# Altium schematic sheet BackPage.SchDoc: Back Page
size Letter; Engineer: Nathan Petersen; DocumentNumber: 26; SheetNumber: 26; SheetTotal: 26
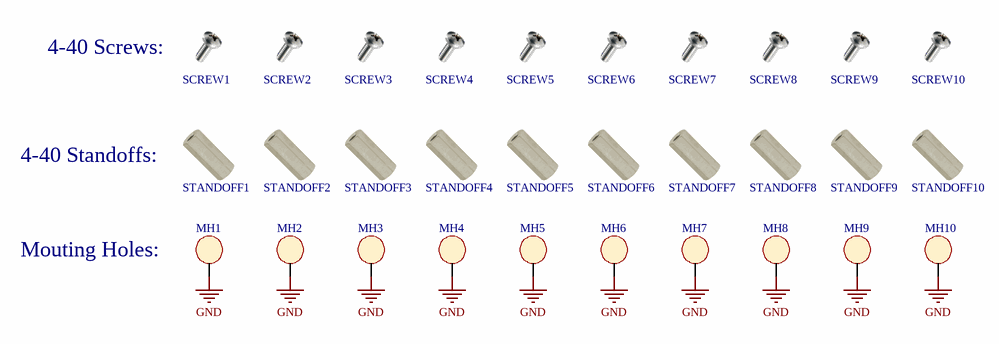
[diagram p0: BackPage.SchDoc]

## Parts
MH1  MOUNT_HOLE  [MOUNTING_HOLE]  (value not drawn)  (no BOM)
MH2  MOUNT_HOLE  [MOUNTING_HOLE]  (value not drawn)  (no BOM)
MH3  MOUNT_HOLE  [MOUNTING_HOLE]  (value not drawn)  (no BOM)
MH4  MOUNT_HOLE  [MOUNTING_HOLE]  (value not drawn)  (no BOM)
MH5  MOUNT_HOLE  [MOUNTING_HOLE]  (value not drawn)  (no BOM)
MH6  MOUNT_HOLE  [MOUNTING_HOLE]  (value not drawn)  (no BOM)
MH7  MOUNT_HOLE  [MOUNTING_HOLE]  (value not drawn)  (no BOM)
MH8  MOUNT_HOLE  [MOUNTING_HOLE]  (value not drawn)  (no BOM)
MH9  MOUNT_HOLE  [MOUNTING_HOLE]  (value not drawn)  (no BOM)
MH10  MOUNT_HOLE  [MOUNTING_HOLE]  (value not drawn)  (no BOM)
SCREW1  Screw-4-40  (value not drawn)  (mechanical)
SCREW2  Screw-4-40  (value not drawn)  (mechanical)
SCREW3  Screw-4-40  (value not drawn)  (mechanical)
SCREW4  Screw-4-40  (value not drawn)  (mechanical)
SCREW5  Screw-4-40  (value not drawn)  (mechanical)
SCREW6  Screw-4-40  (value not drawn)  (mechanical)
SCREW7  Screw-4-40  (value not drawn)  (mechanical)
SCREW8  Screw-4-40  (value not drawn)  (mechanical)
SCREW9  Screw-4-40  (value not drawn)  (mechanical)
SCREW10  Screw-4-40  (value not drawn)  (mechanical)
STANDOFF1  Standoff-4-40  (value not drawn)  (mechanical)
STANDOFF2  Standoff-4-40  (value not drawn)  (mechanical)
STANDOFF3  Standoff-4-40  (value not drawn)  (mechanical)
STANDOFF4  Standoff-4-40  (value not drawn)  (mechanical)
STANDOFF5  Standoff-4-40  (value not drawn)  (mechanical)
STANDOFF6  Standoff-4-40  (value not drawn)  (mechanical)
STANDOFF7  Standoff-4-40  (value not drawn)  (mechanical)
STANDOFF8  Standoff-4-40  (value not drawn)  (mechanical)
STANDOFF9  Standoff-4-40  (value not drawn)  (mechanical)
STANDOFF10  Standoff-4-40  (value not drawn)  (mechanical)

## Nets
GND: MH1.1 MH2.1 MH3.1 MH4.1 MH5.1 MH6.1 MH7.1 MH8.1 MH9.1 MH10.1

## Notes on the sheet
- (near SCREW1) 4-40 Screws:
- (near STANDOFF1) 4-40 Standoffs:
- Mouting Holes:
- Title:
- File:
- Sheet:
- of
- Revision:
- Time:
- Date:
- Engineer:

## Library data of the parts
MH1-MH10 = MOUNT_HOLE: MOUNTING HOLE
SCREW1-SCREW10 = Screw-4-40: Supplier 1: Digi-Key; Supplier Part Number 1: KEY1046-ND
STANDOFF1-STANDOFF10 = Standoff-4-40: Supplier 1: Digi-Key; Supplier Part Number 1: 36-1656-ND